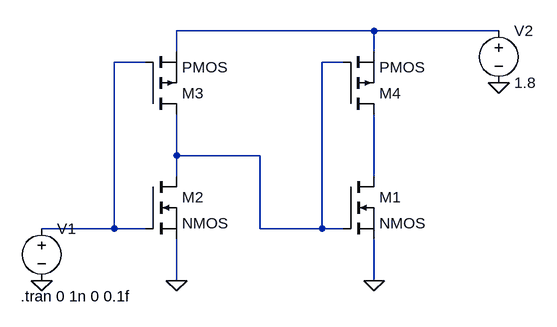
[diagram p0: schematic cmosInverter.asc]
cmosInverter.asc, the LTspice schematic file:
Version 4
SHEET 1 880 680
WIRE 432 -80 128 -80
WIRE 624 -80 432 -80
WIRE 128 -48 128 -80
WIRE 432 -48 432 -80
WIRE 80 -32 32 -32
WIRE 384 -32 352 -32
WIRE 128 112 128 48
WIRE 256 112 128 112
WIRE 128 144 128 112
WIRE 432 144 432 48
WIRE 32 224 32 -32
WIRE 32 224 -80 224
WIRE 80 224 32 224
WIRE 256 224 256 112
WIRE 352 224 352 -32
WIRE 352 224 256 224
WIRE 384 224 352 224
WIRE 128 304 128 240
WIRE 432 304 432 240
FLAG 128 304 0
FLAG 432 304 0
FLAG -80 304 0
FLAG 624 0 0
SYMBOL nmos 384 144 R0
SYMATTR InstName M1
SYMBOL nmos 80 144 R0
SYMATTR InstName M2
SYMBOL pmos 80 48 M180
SYMATTR InstName M3
SYMBOL pmos 384 48 M180
SYMATTR InstName M4
SYMBOL voltage -80 208 R0
WINDOW 3 24 96 Invisible 2
WINDOW 123 0 0 Left 2
WINDOW 39 0 0 Left 2
SYMATTR Value PULSE(0 1.8 0 0 0 0.05n 0.1n)
SYMATTR InstName V1
SYMBOL voltage 624 -96 R0
WINDOW 123 0 0 Left 2
WINDOW 39 0 0 Left 2
SYMATTR InstName V2
SYMATTR Value 1.8
TEXT -112 328 Left 2 !.tran 0 1n 0 0.1f

The netlist it stands for:
* cmosInverter.asc
M1 N004 N003 0 0 NMOS
M2 N003 N002 0 0 NMOS
M3 N003 N002 N001 N001 PMOS
M4 N004 N003 N001 N001 PMOS
V1 N002 0 PULSE(0 1.8 0 0 0 0.05n 0.1n)
V2 N001 0 1.8
.model NMOS NMOS
.model PMOS PMOS
.lib standard.mos
.tran 0 1n 0 0.1f
.backanno
.end